# EAGLE schematic sdc schematic v2.2 (EAGLE 9.6.2)
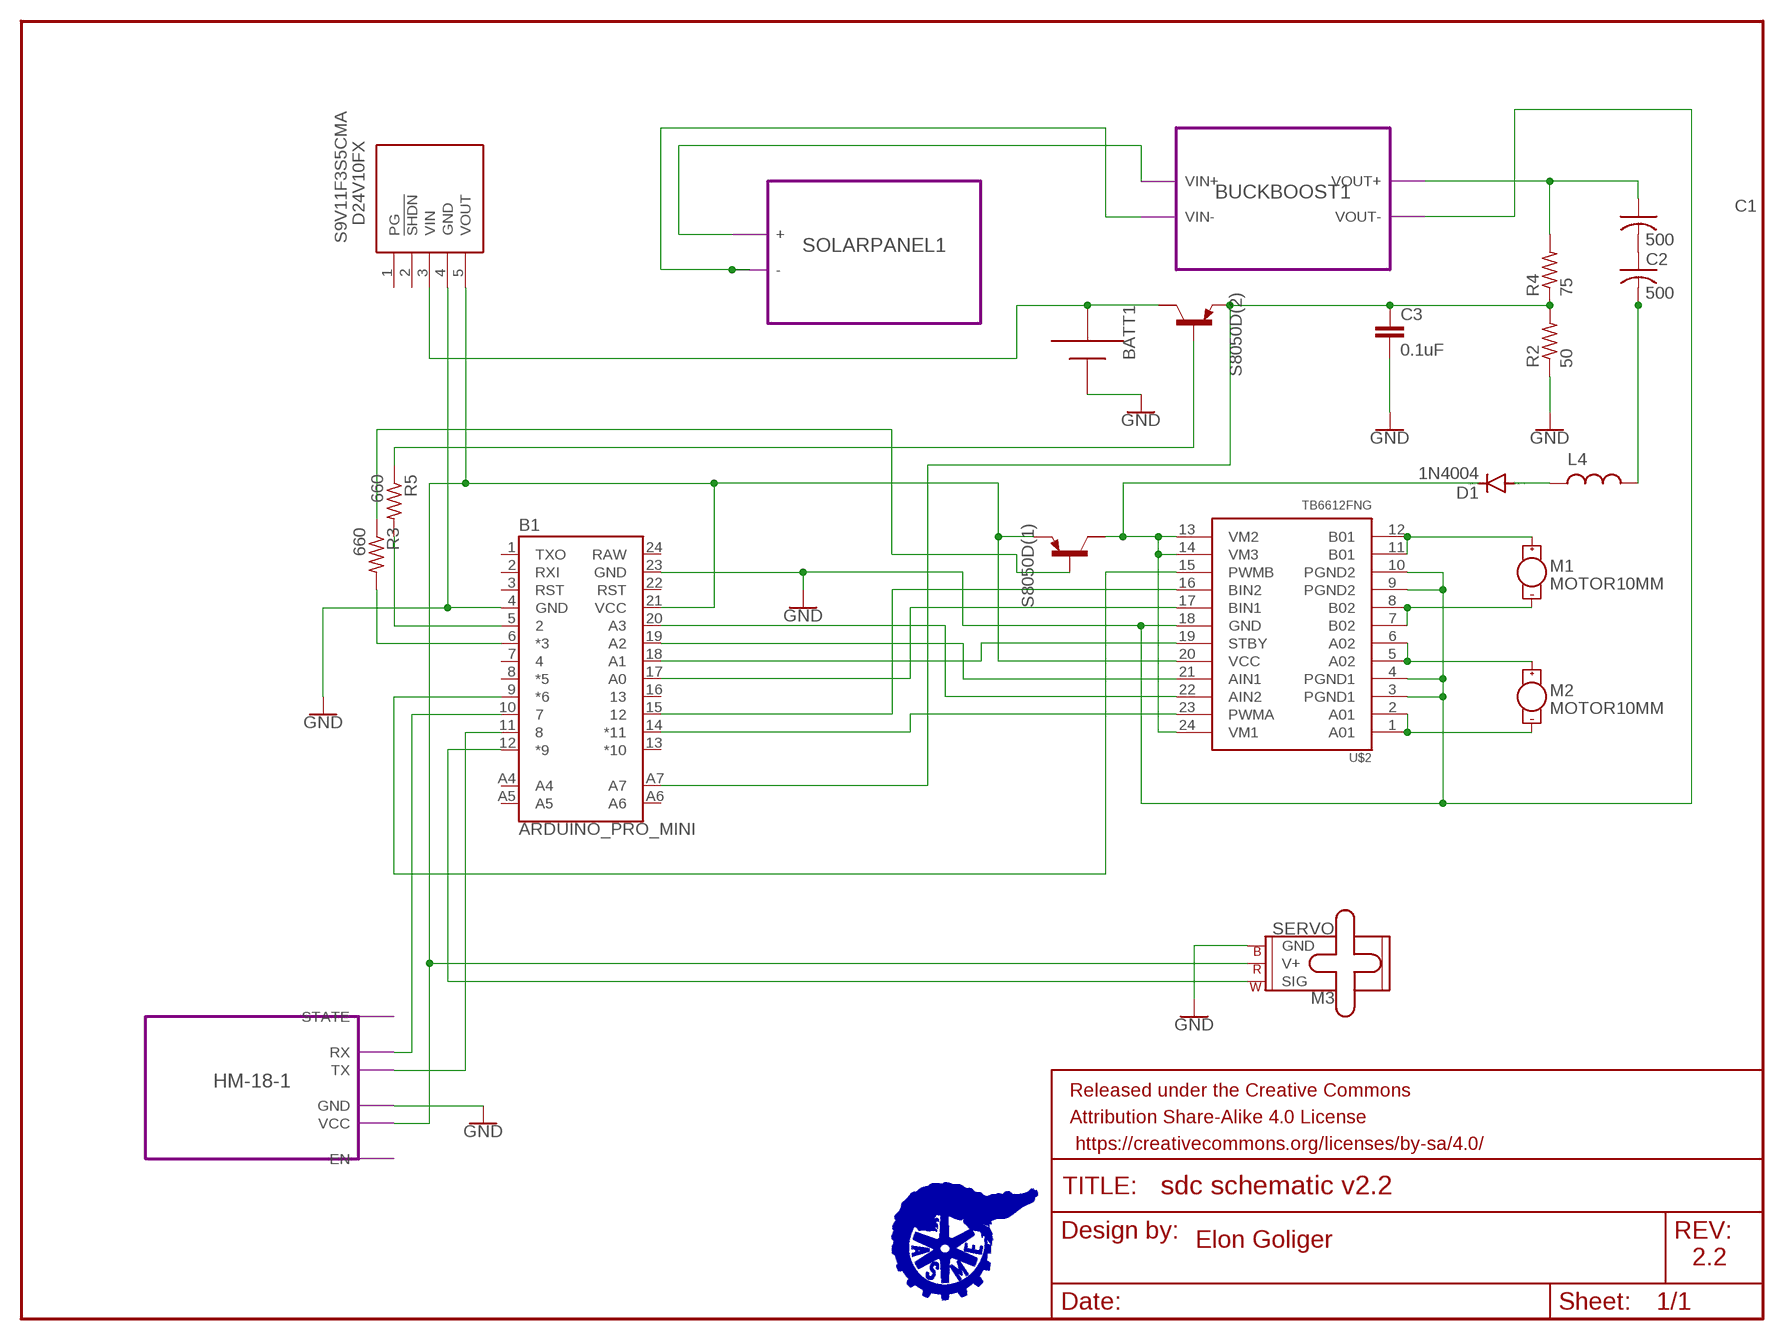
[diagram p0: schematic, sheet 1]

## Parts
B1  ARDUINO_PRO_MINI  [ARDUINO_PRO_MINI]
BATT1  AAA  [12BH412]
C1  500  C-US325-182X374  [C325-182X374]
C2  500  C-US325-182X374  [C325-182X374]
C3  0.1uF  0.1UF-KIT-EZ-50V-20%  [CAP-PTH-SMALL-KIT]
D1  1N4004  [DO41-10]
FRAME1  FRAME-LETTER  [CREATIVE_COMMONS]
L4  L  (no package)
M1  MOTOR10MM  [VIBE-MOTOR-10MM]
M2  MOTOR10MM  [VIBE-MOTOR-10MM]
M3  SERVO  [1X03]
R2  50  R-US_0207/10  [0207/10]
R3  660  R-US_0207/10  [0207/10]
R4  75  R-US_0207/10  [0207/10]
R5  660  R-US_0207/10  [0207/10]
S9V11F3S5CMA  D24V10FX  [D24V10FX]
S8050D(1)  PNP-TRANSISTIOR-2COLSOT89  [SOT89]
S8050D(2)  PNP-TRANSISTIOR-2COLSOT89  [SOT89]
U$2  TB6612FNG  [SSOP24]

## Module instances
SOLARPANEL1 = SOLARPANEL
HM-18-1 = HM-18
BUCKBOOST1 = BUCKBOOST

## Nets
GND: B1.4(GND) B1.23(GND) BATT1.+ C3.2 M3.3(GND) R2.1 S9V11F3S5CMA.4(GND) U$2.3(PGND1) U$2.4(PGND1) U$2.9(PGND2) U$2.10(PGND2) U$2.18(GND) ; port BUCKBOOST1.VOUT- HM-18-1.GND
N$1: B1.14(*11) U$2.23(PWMA)
N$2: B1.9(*6) U$2.15(PWMB)
N$3: C1.2 C2.1
N$4: B1.20(A3) U$2.22(AIN2)
N$5: B1.19(A2) U$2.21(AIN1)
N$6: B1.10 ; port HM-18-1.RX
N$7: B1.17(A0) U$2.17(BIN1)
N$8: B1.15 U$2.16(BIN2)
N$9: B1.11 ; port HM-18-1.TX
N$10: M1.+ U$2.11(B01) U$2.12(B01)
N$11: M1.- U$2.7(B02) U$2.8(B02)
N$12: B1.12(*9) M3.1(SIG)
N$14: M2.+ U$2.5(A02) U$2.6(A02)
N$15: M2.- U$2.1(A01) U$2.2(A01)
N$16: D1.C S8050D(1).2(C) U$2.13(VM2) U$2.14(VM3) U$2.24(VM1)
N$17: port BUCKBOOST1.VIN+ SOLARPANEL1.+
N$18: B1.18(A1) U$2.19(STBY)
N$19: R3.1 S8050D(1).1(B)
N$20: B1.6(*3) R3.2
N$21: B1.21(VCC) M3.2(V+) S9V11F3S5CMA.5(VOUT) S8050D(1).3(E) U$2.20(VCC) ; port HM-18-1.VCC
N$23: R5.1 S8050D(2).1(B)
N$24: C2.2 L4.2
N$25: BATT1.- S9V11F3S5CMA.3(VIN) S8050D(2).2(C)
N$26: B1.A7 C3.1 R2.2 R4.1 S8050D(2).3(E)
N$27: D1.A L4.1
N$28: C1.1 R4.2 ; port BUCKBOOST1.VOUT+
N$30: port BUCKBOOST1.VIN- SOLARPANEL1.-
N$31: B1.5 R5.2
Unconnected: B1.1(TXO) B1.2(RXI) B1.3(RST) B1.7 B1.8(*5) B1.13(*10) B1.16 B1.22(RST) B1.A4 B1.A5 B1.A6 S9V11F3S5CMA.1(PG) S9V11F3S5CMA.2(!SHDN) S8050D(1).2@1(C/) S8050D(2).2@1(C/)

## Notes on the sheet
- Elon Goliger
- 2.2

## Power pins joined to a net without a drawn wire
RAW: B1.24(RAW)

## Library data of the parts
B1 = SparkFun-Boards:ARDUINO_PRO_MINI: SparkFun Pro Mini Pro Mini compatible footprint. Dimensions: 0.7 x 1.3" PCB Thickness: 0.8mm SparkFun Products: 3.3V/8MHz <https://www.sparkfun.com/products/11114> 5V/16MHz <https://www.sparkfun.com/products/11113>
BATT1 = adafruit:AAA: AAA PC pin holder Mouser part #12BH412 - but pretty much any 1x AAA battery holder should be the same http://www.ladyada.net/library/pcb/eaglelibrary.html
C1 C2 = rcl:C-US: CAPACITOR, American symbol; SPICEPREFIX: C
C3 = SparkFun-Capacitors:0.1UF: 0.1µF ceramic capacitors A capacitor is a passive two-terminal electrical component used to store electrical energy temporarily in an electric field.; PROD_ID: CAP-08370
D1 = diode:1N4004: DIODE general purpose rectifier, 1 A
FRAME1 = SparkFun-Aesthetics:FRAME-LETTER: Schematic Frame - Letter Standard 8.5x11 US Letter frame
L4 = ngspice-simulation:L: INDUCTOR
M1 M2 = SparkFun-Electromechanical:MOTOR: Motor (Single-Phase) Two-terminal, single-phase motors. SparkFun Products Vibration Motor <https://www.sparkfun.com/products/8449> (ROB-08449) Physical dimension and wire connections for this powerful vibration motor. Motor has a self adhesive backing.; PROD_ID: COMP-08572; SF_SKU: ROB-08449
M3 = SparkFun-Electromechanical:SERVO: Servo Motor 3-pin connector for a standard servo motor (voltage supply, ground, and control signal.) SparkFun Products Servo - Generic (Sub-Micro Size) <https://www.sparkfun.com/products/9065> (ROB-09065) Servo - Generic High Torque Continuous Rotation (Standard Size) <https://www.sparkfun.com/products/9347> (ROB-09347) Servo - Generic High Torque (Standard Size) <https://www.sparkfun.com/products/11965> (ROB-11965)
R2-R5 = rcl:R-US_: RESISTOR, American symbol; SPICEPREFIX: R
S9V11F3S5CMA = SamacSys_Parts:D24V10FX: Pololu 3.3V, 1A Step-Down Voltage Regulator D24V10F3 Source: Datasheet <https://www.pololu.com/product/2830>; DESCRIPTION: Pololu 3.3V, 1A Step-Down Voltage Regulator D24V10F3; HEIGHT: 3.82mm; MANUFACTURER_NAME: POLOLU ROBOTICS & ELECTRONICS; MANUFACTURER_PART_NUMBER: D24V10FX
S8050D(1) S8050D(2) = semicon-smd-ipc:PNP-TRANSISTIOR-2COL: PNP TRANSISTOR 2 colletor pins
U$2 = SparkFun-IC-Special-Function:TB6612FNG: Toshiba 1A dual motor driver IC-09363; PROD_ID: IC-09363

## Module SPARKFUN3.3VREGULATOR
Ports: 

### Library data of the parts

## Module SOLARPANEL
Ports: +(io) -(io)

### Library data of the parts

## Module HM-18
Ports: STATE(io) RX(io) TX(io) GND(io) VCC(io) EN(io)

### Library data of the parts

## Module S9V11F3S5CMA
Ports: OUT(io) GND(io) IN(io) EN(io) PG(io) SEL(io) REG20B(io)

### Library data of the parts

## Module BUCKBOOST
Ports: VOUT+(io) VOUT-(io) VIN+(io) VIN-(io)

### Library data of the parts